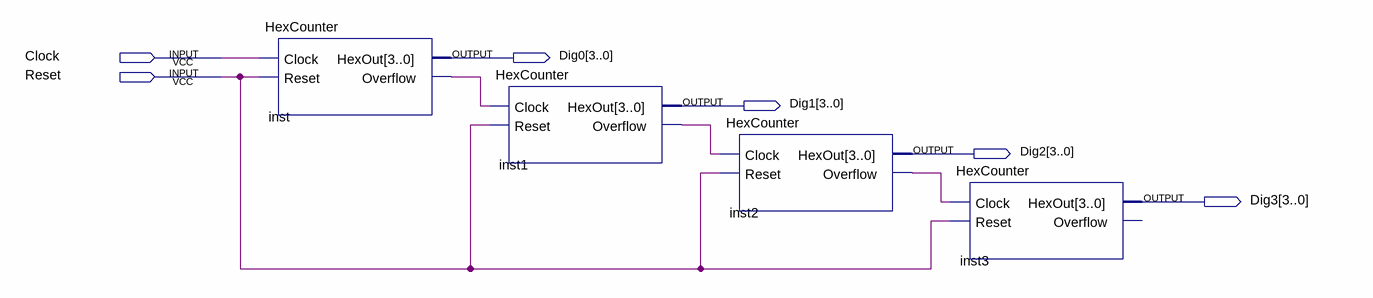
[diagram p0: schematic sheet]
// Quartus schematic RippleClockedCounterBus.bdf as structural Verilog: 4 symbols, 6 pins
module RippleClockedCounterBus (
  input  Clock,
  input  Reset,
  output [3:0] Dig0,
  output [3:0] Dig1,
  output [3:0] Dig2,
  output [3:0] Dig3
);

  wire inst1_overflow, inst2_overflow, inst_overflow;

  HexCounter inst (.Clock(Clock), .Reset(Reset), .HexOut(Dig0), .Overflow(inst_overflow));
  HexCounter inst1 (.Clock(inst_overflow), .Reset(Reset), .HexOut(Dig1), .Overflow(inst1_overflow));
  HexCounter inst2 (.Clock(inst1_overflow), .Reset(Reset), .HexOut(Dig2), .Overflow(inst2_overflow));
  HexCounter inst3 (.Clock(inst2_overflow), .Reset(Reset), .HexOut(Dig3));  // open: Overflow
endmodule
